# Altium project ezFET_Interface_Reference.PrjPcb
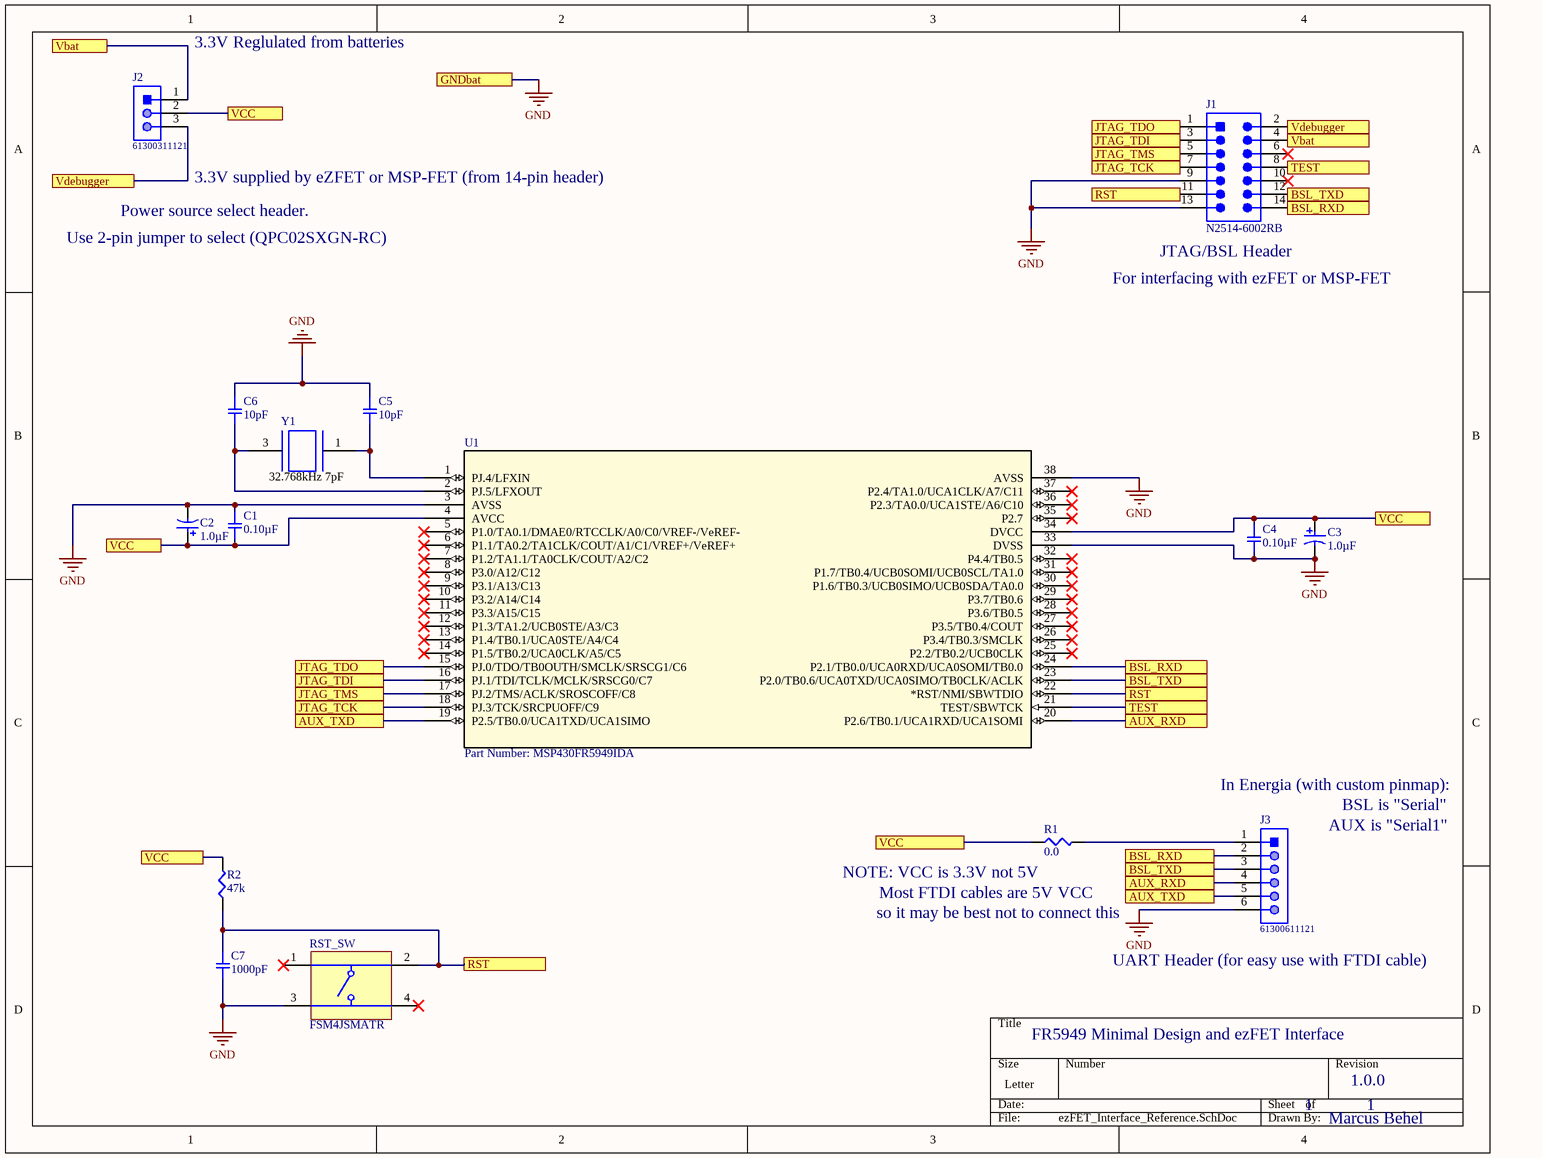
[diagram p0: ezFET_Interface_Reference.SchDoc]
1 sheet, 15 parts. Net scope: flat (ports and power ports of the same name join across sheets).
Board file: ezFET_Interface_Reference.PcbDoc

## Sheet ezFET_Interface_Reference.SchDoc: FR5949 Minimal Design and ezFET Interface
size Letter; Author: Marcus Behel; DrawnBy: Marcus Behel; Revision: 1.0.0; SheetNumber: 1; SheetTotal: 1

### Parts
C1  0.10µF  [SMD-1206C]
C2  Capacitance: 1.0µF  [KEMT-T491A105K016AT_L]  (hidden comment: T491A105K016AT)
C3  Capacitance: 1.0µF  [KEMT-T491A105K016AT_L]  (hidden comment: T491A105K016AT)
C4  0.10µF  [SMD-1206C]
C5  10pF  [SMD-1206C]
C6  10pF  [SMD-1206C]
C7  1000pF  [SMD-1206C]
J1  N2514-6002RB  [3M-N2514-6002RB_V]
J2  61300311121  [61300311121]
J3  61300611121  [61300611121]
R1  0.0  [SMD-1206-RES]
R2  47k  [SMD-1206-RES]
RST_SW  FSM4JSMATR  [TECO-FSM4JSMATR_V]
U1  Part Number: MSP430FR5949IDA  [DA38]
Y1  value 32.768kHz 7pF  [MS3V-T1R-32.768KHZ-7PF-20PPM-TA-QC-AU]  (hidden comment: MS3V-T1R-32.768KHZ-7PF-20PPM-TA-QC-AU)

### Ports
AUX_RXD, AUX_TXD, BSL_RXD, BSL_TXD, GNDbat, JTAG_TCK, JTAG_TDI, JTAG_TDO, JTAG_TMS, RST, TEST, Vbat, VCC, Vdebugger

### Nets
GND: C1.1 C2.2 C3.2 C4.2 C5.1 C6.1 C7.2 J1.9 J1.13 J3.6 RST_SW.3 U1.3(AVSS) U1.33(DVSS) U1.38(AVSS) ; port GNDbat
NetC1_2: C1.2 C2.1 C3.1 C4.1 J2.2 R1.1 R2.2 U1.4(AVCC) U1.34(DVCC) ; port VCC
NetC5_2: C5.2 U1.1(PJ.4/LFXIN) Y1.1(IN)
NetC6_2: C6.2 U1.2(PJ.5/LFXOUT) Y1.3(OUT)
NetC7_1: C7.1 J1.11 R2.1 RST_SW.2 U1.22(*RST/NMI/SBWTDIO) ; port RST
NetJ1_1: J1.1 U1.15(PJ.0/TDO/TB0OUTH/SMCLK/SRSCG1/C6) ; port JTAG_TDO
NetJ1_2: J1.2 J2.3 ; port Vdebugger
NetJ1_3: J1.3 U1.16(PJ.1/TDI/TCLK/MCLK/SRSCG0/C7) ; port JTAG_TDI
NetJ1_4: J1.4 J2.1 ; port Vbat
NetJ1_5: J1.5 U1.17(PJ.2/TMS/ACLK/SROSCOFF/C8) ; port JTAG_TMS
NetJ1_7: J1.7 U1.18(PJ.3/TCK/SRCPUOFF/C9) ; port JTAG_TCK
NetJ1_8: J1.8 U1.21(TEST/SBWTCK) ; port TEST
NetJ1_12: J1.12 J3.3 U1.23(P2.0/TB0.6/UCA0TXD/UCA0SIMO/TB0CLK/ACLK) ; port BSL_TXD
NetJ1_14: J1.14 J3.2 U1.24(P2.1/TB0.0/UCA0RXD/UCA0SOMI/TB0.0) ; port BSL_RXD
NetJ3_1: J3.1 R1.2
NetJ3_4: J3.4 U1.20(P2.6/TB0.1/UCA1RXD/UCA1SOMI) ; port AUX_RXD
NetJ3_5: J3.5 U1.19(P2.5/TB0.0/UCA1TXD/UCA1SIMO) ; port AUX_TXD

Not connected (* = marked no-connect by the designer): J1 6* 10*; RST_SW 1* 4*; U1 5(P1.0/TA0.1/DMAE0/RTCCLK/A0/C0/VREF-/VeREF-)* 6(P1.1/TA0.2/TA1CLK/COUT/A1/C1/VREF+/VeREF+)* 7(P1.2/TA1.1/TA0CLK/COUT/A2/C2)* 8(P3.0/A12/C12)* 9(P3.1/A13/C13)* 10(P3.2/A14/C14)* 11(P3.3/A15/C15)* 12(P1.3/TA1.2/UCB0STE/A3/C3)* 13(P1.4/TB0.1/UCA0STE/A4/C4)* 14(P1.5/TB0.2/UCA0CLK/A5/C5)* 25(P2.2/TB0.2/UCB0CLK)* 26(P3.4/TB0.3/SMCLK)* 27(P3.5/TB0.4/COUT)* 28(P3.6/TB0.5)* 29(P3.7/TB0.6)* 30(P1.6/TB0.3/UCB0SIMO/UCB0SDA/TA0.0)* 31(P1.7/TB0.4/UCB0SOMI/UCB0SCL/TA1.0)* 32(P4.4/TB0.5)* 35(P2.7)* 36(P2.3/TA0.0/UCA1STE/A6/C10)* 37(P2.4/TA1.0/UCA1CLK/A7/C11)*

### Notes on the sheet
- 3.3V Reglulated from batteries
- Power source select header.
- (near J2) 3.3V supplied by eZFET or MSP-FET (from 14-pin header)
- Use 2-pin jumper to select (QPC02SXGN-RC)
- For interfacing with ezFET or MSP-FET
- (near J1) JTAG/BSL Header
- (near J3) In Energia (with custom pinmap):
- AUX is "Serial1"
- BSL is "Serial"
- (near R1) NOTE: VCC is 3.3V not 5V
- (near R1) Most FTDI cables are 5V VCC
- so it may be best not to connect this
- (near J3) UART Header (for easy use with FTDI cable)

### Library data of the parts
C1 C4 = GCM319R71H104KA37D: CAP CER 0.1UF 50V X7R 1206; Manufacturer: Murata Electronics North America; Factory Stock: 0; Unit Price (USD): 0.21; Minimum Quantity: 1; Tolerance: ±10%; Datasheets: http://www.murata.com/~/media/webrenewal/support/library/catalog/products/capacitor/mlcc/c03e.ashx; Image: //media.digikey.com/Renders/Murata%20Renders/GR331BD72E473KW01L.jpg; Digi-Key Part Number: 490-11166-1-ND; Part Number: GCM319R71H104KA37D; Quantity Available: 5066; @ qty: 0; Packaging: Cut Tape (CT); Series: GCM; Part Status: Active; Value: 0.10µF; Voltage: 50V; Temperature Coefficient: X7R; Operating Temperature: -55°C ~ 125°C; Features: -; Ratings: AEC-Q200; Applications: Automotive; Mounting Type: Surface Mount, MLCC; Package / Case: 1206 (3216 Metric); Size / Dimension: 0.126" L x 0.063" W (3.20mm x 1.60mm); Height - Seated (Max): -; Thickness (Max): 0.037" (0.95mm); Lead Spacing: -; Lead Style: -
C2 C3 = CMP-2000-07186-1: Tantalun Capacitor, 1 uF, +/- 10%, 16 V, -55 to 125 degC, 2-Pin SMD, RoHS, Tape and Reel; Manufacturer: Kemet; Manufacturer Size Code: A; Type: Molded; Online Catalog: T491Series; Lifetime @ Temp.: 2000Hrs@85°C; Catalog Drawings: T49x,T5xxSeries_A-side1T49x,T5xxSeries_A,B-side2T49x,T5xxSeries_A,SBottom; Other Names: 399-3678-6; EDA / CAD Models: DownloadfromAcceleratedDesigns; ESR (Equivalent Series Resistance): 10Ohm; Voltage - Rated: 16V; Product Training Modules: CapacitorBasics-TypicalUsesforCapacitorsDeratingGuidelinesforSurfaceMountTantalumCapacitors; Category: Capacitors; Lead Spacing: -; Package Description: 2-Pin Surface Mounted Device, Body 3.2 x 1.6 mm; Height - Seated (Max): 0.071"(1.80mm); Mounting Technology: SurfaceMount; Mounting Type: SurfaceMount; Standard Package: 1; Tolerance: ±10%; Datasheet Version: 06/2016; Manufacturer URL: http://www.kemet.com/; Packaging: Digi-Reel®; Family: TantalumCapacitors; Series: T491; Size / Dimension: 0.126"Lx0.063"W(3.20mmx1.60mm); Package / Case: 1206(3216Metric); Datasheet URL: http://capacitoredge.kemet.com/capedge2/DataSheet/Datasheet-T491A105K016AT.pdf?pn=T491A105K016AT; Operating Temperature: -55°C~125°C; Package Reference: 1206; Features: GeneralPurpose
C5 C6 = GCM31A7U2J100JX01D: CAP CER 10PF 630V U2J 1206; Manufacturer: Murata Electronics North America; Factory Stock: 0; Unit Price (USD): 0.52; Minimum Quantity: 1; Tolerance: ±5%; Datasheets: http://www.murata.com/~/media/webrenewal/support/library/catalog/products/capacitor/mlcc/c03e.ashx; Image: //media.digikey.com/Renders/Murata%20Renders/GR331BD72E473KW01L.jpg; Digi-Key Part Number: 490-5037-1-ND; Part Number: GCM31A7U2J100JX01D; Quantity Available: 4301; @ qty: 0; Packaging: Cut Tape (CT); Series: GCM; Part Status: Active; Value: 10pF; Voltage: 630V; Temperature Coefficient: U2J; Operating Temperature: -55°C ~ 125°C; Features: -; Ratings: AEC-Q200; Applications: Automotive; Mounting Type: Surface Mount, MLCC; Package / Case: 1206 (3216 Metric); Size / Dimension: 0.126" L x 0.063" W (3.20mm x 1.60mm); Height - Seated (Max): -; Thickness (Max): 0.039" (1.00mm); Lead Spacing: -; Lead Style: -
C7 = GRM319R71H102KA01D: CAP CER 1000PF 50V X7R 1206; Manufacturer: Murata Electronics North America; Factory Stock: 0; Unit Price (USD): 0.19; Minimum Quantity: 1; Tolerance: ±10%; Datasheets: http://www.murata.com/~/media/webrenewal/support/library/catalog/products/capacitor/mlcc/c02e.pdf; Image: //media.digikey.com/Renders/Murata%20Renders/GR331BD72E473KW01L.jpg; Digi-Key Part Number: 490-11610-1-ND; Part Number: GRM319R71H102KA01D; Quantity Available: 4837; @ qty: 0; Packaging: Cut Tape (CT); Series: GRM; Part Status: Active; Value: 1000pF; Voltage: 50V; Temperature Coefficient: X7R; Operating Temperature: -55°C ~ 125°C; Features: -; Ratings: -; Applications: General Purpose; Mounting Type: Surface Mount, MLCC; Package / Case: 1206 (3216 Metric); Size / Dimension: 0.126" L x 0.063" W (3.20mm x 1.60mm); Height - Seated (Max): -; Thickness (Max): 0.037" (0.95mm); Lead Spacing: -; Lead Style: -
J1 = CMP-2000-06795-1: Male Header, Pitch 2.54 mm, 2 x 7 Position, Height 9.91 mm, Tail Length 2.84 mm, -55 to 105 degC, RoHS, Tray; Manufacturer: 3M; No. of Rows: 2; PCB Hole Diameter: 0.89mm; Connector Type: WiretoBoard; Insulation Resistance Voltage: 500V; Current Temperature: 70°C; Insulation Resistance: 1000Mohm; No. of Contacts: 14; Voltage Rating V AC: 350V; PCB Hole Tolerance -: 0.08mm; No. of Mating Cycles: 200; Pitch Spacing: 2.54mm; Contact Resistance: 20mohm; Current Rating: 2A; RMS Current Max: 1A; Contact Termination: ThroughHoleVertical; Package Description: Male Header, Pitch 2.54 mm, 2 x 7 Position, Height 9.91 mm, Tail Length 2.84 mm; Operating Temperature Max: 105°C; Gender: Header; Flammability Rating: UL94V-0; Datasheet Version: 12/2011; Package Reference: N2514-6002RB; Colour: Black; Contact Material: PhosphorBronze; PCB Hole Tolerance +: 0.08mm; Series: 2500; No. of Poles: 14; Datasheet URL: http://www.farnell.com/datasheets/1624904.pdf; Lead Spacing: 2.54mm; No. of Ways: 14; Working Voltage: 350V; No. of Pins: 14; Manufacturer URL: http://www.3m.com/; Operating Temperature Min: -55°C; Contact Plating: GoldoverNickel; Termination Method: Solder; Mounting Technology: ThroughHole
J2 = CMP-1502-01062-1: THT Vertical Pin Header WR-PHD, Pitch 2.54 mm, Single Row, 3 pins; Manufacturer: Wurth Elektronik; Withstanding Voltage: 500VAC; Working Voltage: 250VAC; Rated Current: 3A; Pitch: 2.54mm; Pin Number: 3; Gender: Male; Contact Resistance: 20mOhm; Package Reference: 61300311121; Manufacturer URL: http://www.we-online.de; Datasheet URL: https://katalog.we-online.de/em/datasheet/6130xx11121.pdf; Operating Temperature: -40to105degC; Part Number: 61300311121; Orientation: Vertical; Packaging: Bag; Row Number: Single; Mounting Technology: THT; Publisher: WurthElektronik
J3 = CMP-1502-01070-1: THT Vertical Pin Header WR-PHD, Pitch 2.54 mm, Single Row, 6 pins; Manufacturer: Wurth Elektronik; Gender: Male; Pin Number: 6; Pitch: 2.54mm; Working Voltage: 250VAC; Rated Current: 3A; Withstanding Voltage: 500VAC; Contact Resistance: 20mOhm; Operating Temperature: -40to105degC; Packaging: Bag; Datasheet URL: https://katalog.we-online.de/em/datasheet/6130xx11121.pdf; Package Reference: 61300611121; Mounting Technology: THT; Publisher: WurthElektronik; Part Number: 61300611121; Manufacturer URL: http://www.we-online.de; Row Number: Single; Orientation: Vertical
R1 = ERJ-8GEY0R00V: RES SMD 0.0 OHM JUMPER 1/4W 1206; Manufacturer: Panasonic Electronic Components; Factory Stock: 0; Unit Price (USD): 0.00768; @ qty: 1500; Minimum Quantity: 1; Power (Watts): 0.25W, 1/4W; Part Number: ERJ-8GEY0R00V; Datasheets: http://industrial.panasonic.com/www-cgi/jvcr13pz.cgi?E+PZ+3+AOA0001+ERJ8GEY0R00V+7+WW; Image: //media.digikey.com/Renders/Panasonic%20Renders/ERJ-1206%20Pkg.jpg; Digi-Key Part Number: P0.0ECT-ND; Quantity Available: 1074190; Packaging: Cut Tape (CT); Series: ERJ; Part Status: Active; Value: 0.0; Tolerance: Jumper; Composition: Thick Film; Features: Automotive AEC-Q200; Temperature Coefficient: -; Operating Temperature: -55°C ~ 155°C; Package / Case: 1206 (3216 Metric); Supplier Device Package: 1206; Size / Dimension: 0.126" L x 0.063" W (3.20mm x 1.60mm); Height - Seated (Max): 0.028" (0.70mm); Number of Terminations: 2; Failure Rate: -
R2 = ERJ-P08J473V: RES SMD 47K OHM 5% 2/3W 1206; Manufacturer: Panasonic Electronic Components; Factory Stock: 0; Unit Price (USD): 0.02178; @ qty: 1500; Minimum Quantity: 1; Power (Watts): 0.667W, 2/3W; Temperature Coefficient: ±200ppm/°C; Part Number: ERJ-P08J473V; Datasheets: https://industrial.panasonic.com/cdbs/www-data/pdf/RDA0000/AOA0000C243.pdf; Image: //media.digikey.com/Renders/Panasonic%20Renders/ERJ-1206%20Pkg.jpg; Digi-Key Part Number: P47KALCT-ND; Quantity Available: 29484; Packaging: Cut Tape (CT); Series: ERJ; Part Status: Active; Value: 47k; Tolerance: ±5%; Composition: Thick Film; Features: Automotive AEC-Q200, Pulse Withstanding; Operating Temperature: -55°C ~ 155°C; Package / Case: 1206 (3216 Metric); Supplier Device Package: 1206; Size / Dimension: 0.126" L x 0.063" W (3.20mm x 1.60mm); Height - Seated (Max): 0.028" (0.70mm); Number of Terminations: 2; Failure Rate: -
RST_SW = CMP-2000-07486-1: Micro Miniature Push Button Switch FSM JSM, 50 mA, -35 to 85 degC, 4-Pin SMD, RoHS, Tape and Reel; Manufacturer: TE Connectivity; Mechanical Life: 100000Cycles; Current Rating: 50mA; Actuator Material: Polyamide; Max Voltage Rating (DC): 12V; Capacitance: 0f; Illumination Type: Illuminated; Voltage Rating (DC): 24V; Case\/Package: SMD/SMT; Operating Force: 160gf; Contact Resistance: 100mOhm; Actuator Length: 0.055inch; Switch Travel: 0.25mm; Throw Configuration: SPST; Termination: GullWing; Contact Plating: Silver; Orientation: Straight; Mounting Technology: SurfaceMount; REACH SVHC: Unknown; Electrical Life: 100000Cycles; Package Reference: FSM4JSMATR; Max Operating Temperature: 85degC; Manufacturer URL: http://www.te.com/; Package Description: 4-Pin Surface Mount Device, Body 6 x 6 mm, Pitch 4.5 mm; Datasheet Version: Rev. V, 02/2015; Packaging: TapeandReel; Min Operating Temperature: -35degC; Mount: SurfaceMount; Contact Current Rating: 50mA; Contact Material: CopperAlloy; Package Quantity: 1200; Datasheet URL: http://www.te.com/commerce/DocumentDelivery/DDEController?Action=showdoc&DocId=Customer+Drawing%7F2-1437565-7%7FV%7Fpdf%7FEnglish%7FENG_CD_2-1437565-7_V.pdf%7F4-1437565-2; RoHSCompliant: true
U1 = MSP430FR5949IDA: No Description Available; Vendor: Texas Instruments; Built_By: EMA_UL_Team; Manufacturer_Part_Number: MSP430FR5949IDA; Copyright: Copyright (C) 2018 Accelerated Designs. All rights reserved; RefDes: RefDes; Type: DEV; Value: Value
Y1 = MS3V-T1R-32.768KHZ-7PF-20PPM-TA-QC-AU: No Description Available; Manufacturer_Part_Number: MS3V-T1R-32.768KHZ-7PF-20PPM-TA-QC-AU